# EAGLE design Add-OnV12 (EAGLE 6.3)
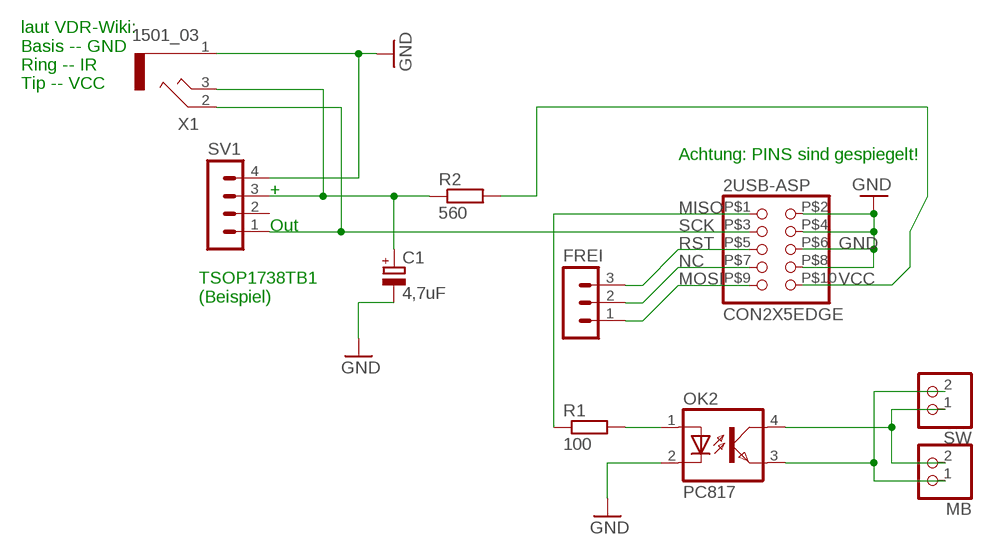
[diagram p0: schematic, sheet 1]

## Parts
2USB-ASP  CON2X5EDGE  [CON2X5EDGE]
C1  4,7uF  CPOL-EUE1.8-4  [E1,8-4]
FREI  MA03-1  [MA03-1]
MB  PINHD-1X2  [1X02]
OK2  PC817  [DIL04]
R1  100  R-EU_0204/2V  [0204V]
R2  560  R-EU_0204/2V  [0204V]
SV1  MA04-1  [MA04-1]
SW  PINHD-1X2  [1X02]
X1  1501_03  [1501_03]

## Nets
GND: 2USB-ASP.P$2 2USB-ASP.P$4 2USB-ASP.P$6 2USB-ASP.P$8 C1.- OK2.2(C) SV1.4 X1.1
MISO: 2USB-ASP.P$1 R1.1
MOSI: 2USB-ASP.P$9 FREI.1
N$1: C1.+ R2.1 SV1.3 X1.3
N$2: OK2.1(A) R1.2
N$3: MB.2 OK2.4(COL) SW.1
N$4: MB.1 OK2.3(EMIT) SW.2
NC: 2USB-ASP.P$7 FREI.2
RST: 2USB-ASP.P$5 FREI.3
SCK: 2USB-ASP.P$3 SV1.1 X1.2
VCC: 2USB-ASP.P$10 R2.2
Unconnected: SV1.2

## Notes on the sheet
- laut VDR-Wiki:
  Basis -- GND
  Ring -- IR
  Tip -- VCC
- Achtung: PINS sind gespiegelt!
- +
- Out
- TSOP1738TB1
  (Beispiel)

## Library data of the parts
2USB-ASP = schwen:CON2X5EDGE
C1 = rcl:CPOL-EU: POLARIZED CAPACITOR, European symbol
FREI = con-lstb:MA03-1: PIN HEADER; OC_FARNELL: unknown; OC_NEWARK: unknown
MB SW = pinhead:PINHD-1X2: PIN HEADER
OK2 = optocoupler:PC817: SHARP OPTO COUPLER; MPN: PC817X4J000F; OC_FARNELL: 9707727; OC_NEWARK: 97K7059
R1 R2 = rcl:R-EU_: RESISTOR, European symbol
SV1 = con-lstb:MA04-1: PIN HEADER; OC_FARNELL: unknown; OC_NEWARK: unknown
X1 = con-lumberg:1501_03: Klinkensteckverbinder nach JISC 6560, 2,5 mm Jack connectors according to JISC 6560, 2.5 mm Source: http://www.lumberg.com/Produkte/PDFs/1501_03.pdf; OC_FARNELL: 1200127; OC_NEWARK: unknown

## Board
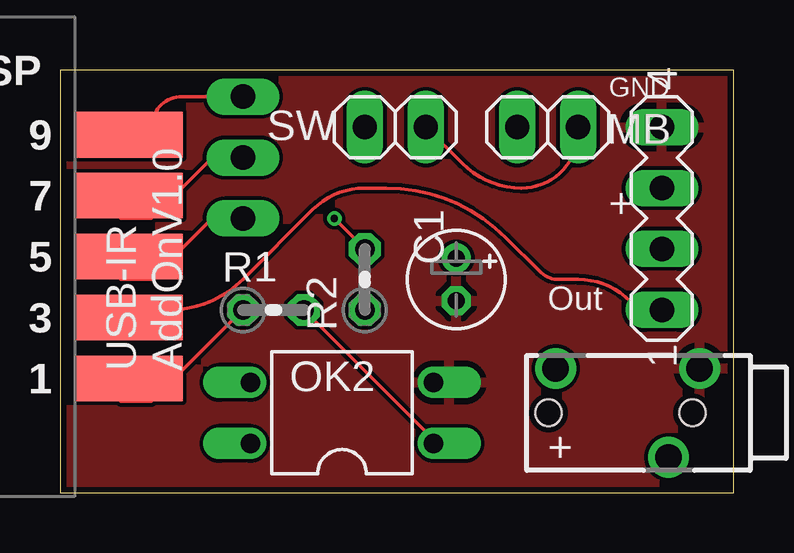
[diagram p1: board, top side]
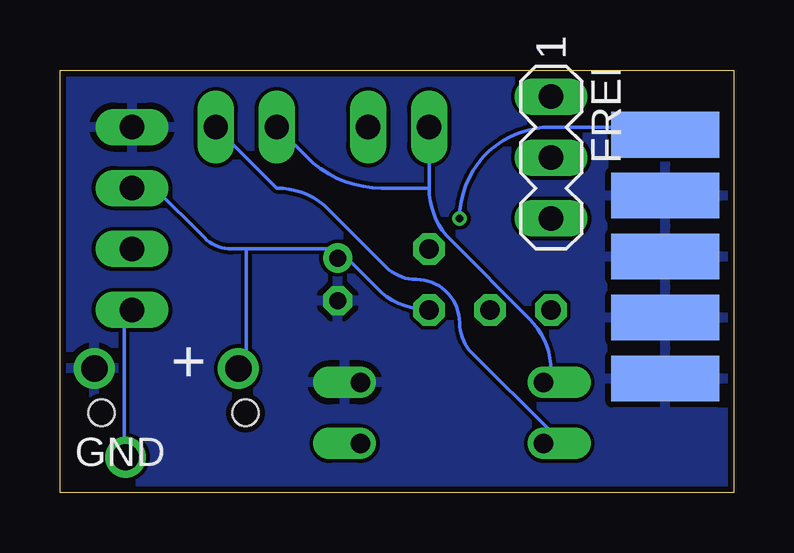
[diagram p2: board, bottom side, seen from below]

Size 28.08 x 17.61 mm. Coordinates in mm from the lower left corner, seen from the top.
Outline: 0,0 28.08,0 28.08,17.61 0,17.61 0,0
Copper layers (1*16): Top 0.035mm / dielectric 1.5mm / Bottom 0.035mm
Design rules "Fusion_eagle_rule_v1.1": minimum track width 6mil, minimum drill 12mil, track to track 6mil, track to pad 6mil, pad to pad 6mil, via to via 6mil, smd to smd 0mil, copper to edge 10mil, drill to drill 10mil, minimum pad ring 10mil, minimum via ring 6mil, stop-mask expansion 2mil, vias tented up to drill 100mil, thermal gap 10mil

### Footprints (pad centres in the part's own frame; a part is rotated, then mirrored left to right if it is on the bottom)
CON2X5EDGE = smd 4.5 x 1.9: P$1 0,5.08; P$3 0,2.54; P$5 0,0; P$7 0,-2.54; P$9 0,-5.08 | smd 4.5 x 1.9 bottom: P$2 0,5.08; P$4 0,2.54; P$6 0,0; P$8 0,-2.54; P$10 0,-5.08
E1,8-4 = drill 0.711 pad 1.168: + -0.889,0 | drill 0.711 pad 1.168 octagon: - 0.889,0
MA03-1 = drill 1.016 long: 1 -2.54,0; 2 0,0; 3 2.54,0
1X02 = drill 1.016 long: 1 -1.27,0; 2 1.27,0
DIL04 = drill 0.813 offset: 1 -1.27,-3.81; 2 1.27,-3.81; 3 1.27,3.81; 4 -1.27,3.81
0204V = drill 0.813 octagon: 1 -1.27,0; 2 1.27,0
MA04-1 = drill 1.016 long: 1 -3.81,0; 2 -1.27,0; 3 1.27,0; 4 3.81,0
1501_03 = drill 1.1 pad 1.7: 1 -1.85,0.3; 2 1.85,-1; 3 -1.85,-5.7 | hole 1.1: 0,0; 0,-6

### Placement (x,y rotation side)
2USB-ASP  2.86,9.84 180 top
C1  16.51,8.89 270 top
FREI  7.62,13.97 270 bottom
MB  20.32,15.24 0 top
OK2  11.75,3.33 90 top
R1  8.89,7.62 0 top
R2  12.7,8.89 90 top
SV1  25.08,11.43 90 top
SW  13.97,15.24 180 top
X1  26.35,3.33 270 top

### Tracks (layer width: path | path; a pad name or v marks a point on that pad's centre or on a via)
GND
  pour Bottom: 0,17.78 0,0 27.94,0 27.94,17.78
  pour Top: 0,17.78 27.94,17.78 27.94,0 0,0
MISO
  Top 0.152: R1.1 3.81,3.81 2.54,3.81 2.54,5.08 2USB-ASP.P$1
MOSI
  Top 0.152: FREI.1 5.08,16.51 arc90 3.81,15.24 2USB-ASP.P$9
N$1
  Bottom 0.152: R2.1 arc45 14.87,8.52 16.51,10.16 | 20.32,10.16 20.93,10.16 arc45 22.06,10.63 24.13,12.7 SV1.3 | 16.51,10.16 20.32,10.16 | 16.51,10.16 C1.+ | 20.32,10.16 20.32,5.08 X1.3
N$2
  Top 0.152: R1.2 15.24,2.54 OK2.1
N$3
  Top 0.152: MB.2 21.59,15.06 arc-90 19.23,12.7 arc-45 16.76,13.72 SW.1
  Bottom 0.152: MB.2 19.05,12.7 arc45 16.88,11.8 14.49,9.41 arc-45 13.24,8.89 arc90 11.43,7.08 arc-45 10.91,5.83 7.62,2.54 OK2.4
N$4
  Bottom 0.152: 12.7,12.7 12.7,12.7 arc-45 11.8,10.54 8.52,7.25 arc45 7.62,5.08 OK2.3 | SW.2 12.7,12.7 | 12.7,12.7 14.68,12.7 arc45 17.8,13.99 MB.1
NC
  Top 0.152: FREI.2 6.35,13.97 3.81,11.43 2.54,11.43 2.54,12.7 2USB-ASP.P$7
RST
  Top 0.152: FREI.3 6.35,11.43 3.81,8.89 2.54,8.89 2.54,10.16 2USB-ASP.P$5
SCK
  Top 0.152: 2USB-ASP.P$3 3.81,7.62 4.54,7.62 arc45 7.63,8.9 10.54,11.8 arc-45 12.7,12.7 13.59,12.7 arc-45 18.57,10.64 19.98,9.23 arc45 20.8,8.89 21.59,8.89 arc-45 23.76,7.99 24.13,7.62 SV1.1
  Bottom 0.152: SV1.1 25.4,7.62 25.4,1.27 X1.2
VCC  (via drill 0.3)
  Top 0.152: v11.43,11.43 R2.2
  Bottom 0.152: v11.43,11.43 arc90 7.62,15.24 3.81,15.24 2USB-ASP.P$10

### Text on the board
tNames: GND | + | Out | USB-IR / AddOnV1.0 | +
bNames: + | GND